# Altium schematic sheet On_board_front_end.SchDoc
size A4
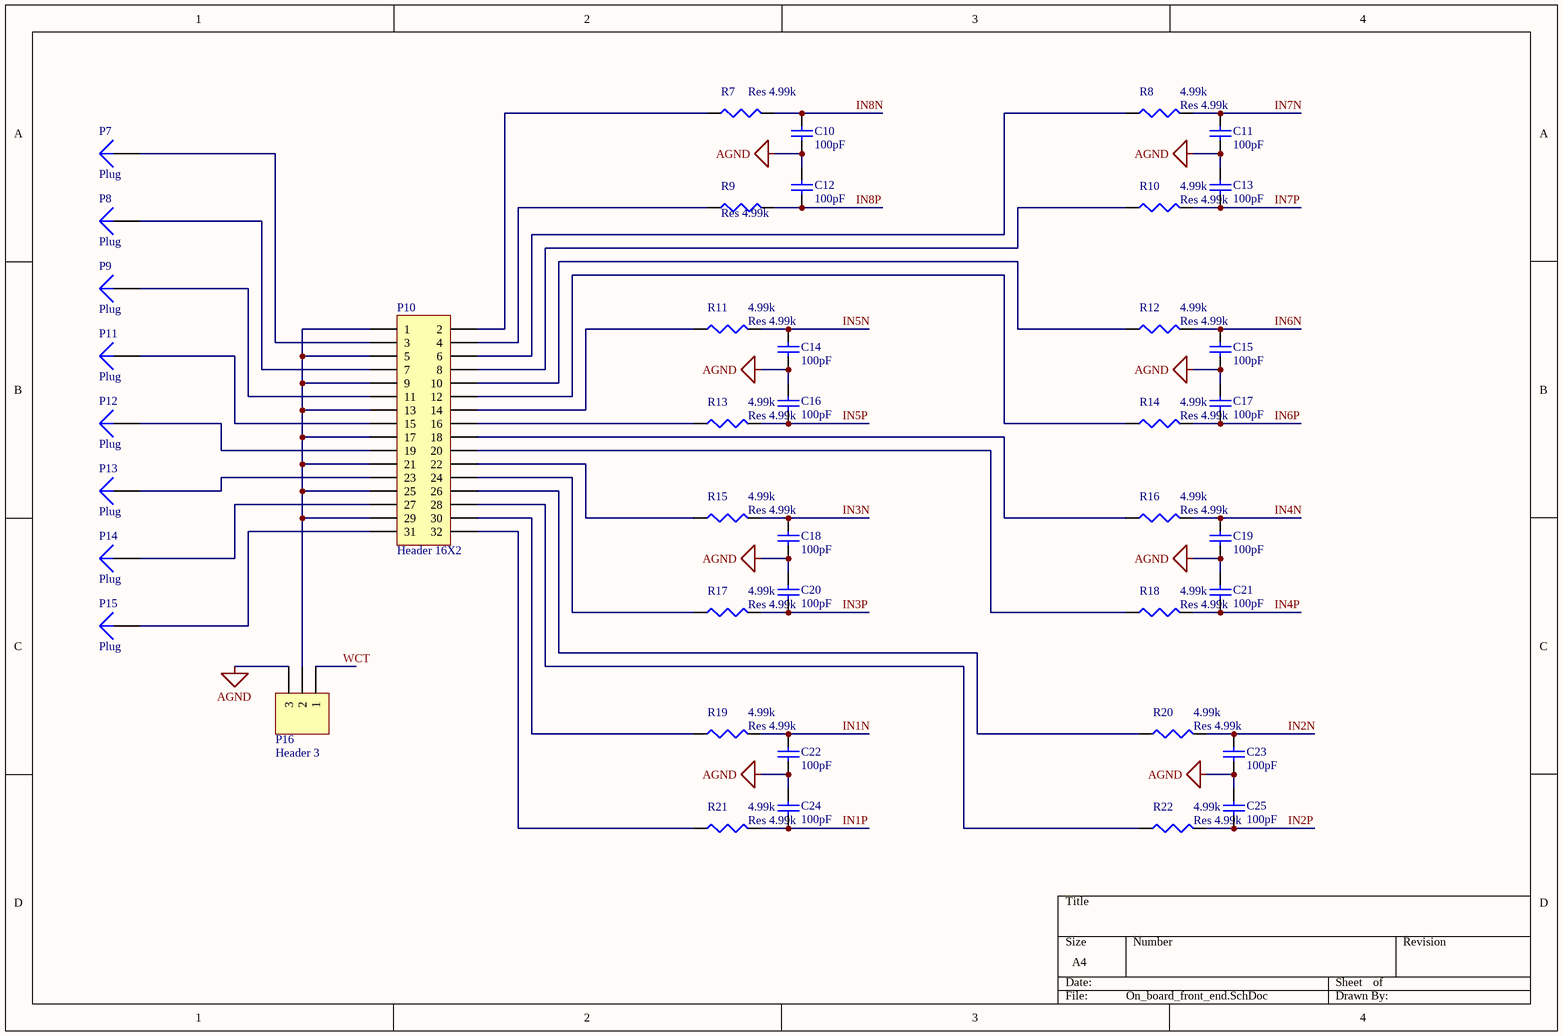
[diagram p0: On_board_front_end.SchDoc]

## Parts
C10  value 100pF  [1608[0603]]  (hidden comment: Cap 100pF)
C11  value 100pF  [1608[0603]]  (hidden comment: Cap 100pF)
C12  value 100pF  [1608[0603]]  (hidden comment: Cap 100pF)
C13  value 100pF  [1608[0603]]  (hidden comment: Cap 100pF)
C14  value 100pF  [1608[0603]]  (hidden comment: Cap 100pF)
C15  value 100pF  [1608[0603]]  (hidden comment: Cap 100pF)
C16  value 100pF  [1608[0603]]  (hidden comment: Cap 100pF)
C17  value 100pF  [1608[0603]]  (hidden comment: Cap 100pF)
C18  value 100pF  [1608[0603]]  (hidden comment: Cap 100pF)
C19  value 100pF  [1608[0603]]  (hidden comment: Cap 100pF)
C20  value 100pF  [1608[0603]]  (hidden comment: Cap 100pF)
C21  value 100pF  [1608[0603]]  (hidden comment: Cap 100pF)
C22  value 100pF  [1608[0603]]  (hidden comment: Cap 100pF)
C23  value 100pF  [1608[0603]]  (hidden comment: Cap 100pF)
C24  value 100pF  [1608[0603]]  (hidden comment: Cap 100pF)
C25  value 100pF  [1608[0603]]  (hidden comment: Cap 100pF)
P7  Plug  [PIN1]
P8  Plug  [PIN1]
P9  Plug  [PIN1]
P10  Header 16X2  [HDR2X16]
P11  Plug  [PIN1]
P12  Plug  [PIN1]
P13  Plug  [PIN1]
P14  Plug  [PIN1]
P15  Plug  [PIN1]
P16  Header 3  [HDR1X3]
R7  Res 4.99k  [0402]
R8  Res 4.99k  value 4.99k  [0402]
R9  Res 4.99k  [0402]
R10  Res 4.99k  value 4.99k  [0402]
R11  Res 4.99k  value 4.99k  [0402]
R12  Res 4.99k  value 4.99k  [0402]
R13  Res 4.99k  value 4.99k  [0402]
R14  Res 4.99k  value 4.99k  [0402]
R15  Res 4.99k  value 4.99k  [0402]
R16  Res 4.99k  value 4.99k  [0402]
R17  Res 4.99k  value 4.99k  [0402]
R18  Res 4.99k  value 4.99k  [0402]
R19  Res 4.99k  value 4.99k  [0402]
R20  Res 4.99k  value 4.99k  [0402]
R21  Res 4.99k  value 4.99k  [0402]
R22  Res 4.99k  value 4.99k  [0402]

## Nets
AGND: C10.2 C11.2 C12.1 C13.1 C14.2 C15.2 C16.1 C17.1 C18.2 C19.2 C20.1 C21.1 C22.2 C23.2 C24.1 C25.1 P16.3
IN1N: C22.1 R19.2
IN1P: C24.2 R21.2
IN2N: C23.1 R20.2
IN2P: C25.2 R22.2
IN3N: C18.1 R15.2
IN3P: C20.2 R17.2
IN4N: C19.1 R16.2
IN4P: C21.2 R18.2
IN5N: C14.1 R11.2
IN5P: C16.2 R13.2
IN6N: C15.1 R12.2
IN6P: C17.2 R14.2
IN7N: C11.1 R8.2
IN7P: C13.2 R10.2
IN8N: C10.1 R7.2
IN8P: C12.2 R9.2
WCT: P16.1
NetP7_1: P7.1 P10.3
NetP8_1: P8.1 P10.7
NetP9_1: P9.1 P10.11
NetP10_1: P10.1 P10.5 P10.9 P10.13 P10.17 P10.21 P10.25 P10.29 P16.2
NetP10_2: P10.2 R7.1
NetP10_4: P10.4 R9.1
NetP10_6: P10.6 R8.1
NetP10_8: P10.8 R10.1
NetP10_10: P10.10 R12.1
NetP10_12: P10.12 R14.1
NetP10_14: P10.14 R11.1
NetP10_15: P10.15 P11.1
NetP10_16: P10.16 R13.1
NetP10_18: P10.18 R16.1
NetP10_19: P10.19 P12.1
NetP10_20: P10.20 R18.1
NetP10_22: P10.22 R15.1
NetP10_23: P10.23 P13.1
NetP10_24: P10.24 R17.1
NetP10_26: P10.26 R20.1
NetP10_27: P10.27 P14.1
NetP10_28: P10.28 R22.1
NetP10_30: P10.30 R19.1
NetP10_31: P10.31 P15.1
NetP10_32: P10.32 R21.1

## Library data of the parts
C10-C25 = Cap: Capacitor; Published: 8-Jun-2000; LatestRevisionDate: 17-Jul-2002; LatestRevisionNote: Re-released for DXP Platform.; PackageReference: RAD-0.3; Publisher: Altium Limited; PackageDescription: Radial Cap, Thru-Hole; 2 Leads; 0.3 in Pin Spacing
P10 = Header 16X2: Header, 16-Pin, Dual row; LatestRevisionDate: 17-Jul-2002; LatestRevisionNote: Re-released for DXP Platform.; Publisher: Altium Limited
P16 = Header 3: Header, 3-Pin; LatestRevisionDate: 17-Jul-2002; LatestRevisionNote: Re-released for DXP Platform.; Publisher: Altium Limited
R7-R22 = Res3: Resistor; Published: 8-Jun-2000; LatestRevisionDate: 29-May-2009; LatestRevisionNote: IPC-7351 Footprint Added.; PackageReference: J1-0603; Publisher: Altium Limited; PackageDescription: Chip Resistor
P7-P9 P11-P15 = Plug: LatestRevisionDate: 17-Jul-2002; LatestRevisionNote: Re-released for DXP Platform.; Publisher: Altium Limited